# EAGLE design snc98_3x4_Switch-futuba (EAGLE 6.6.0)
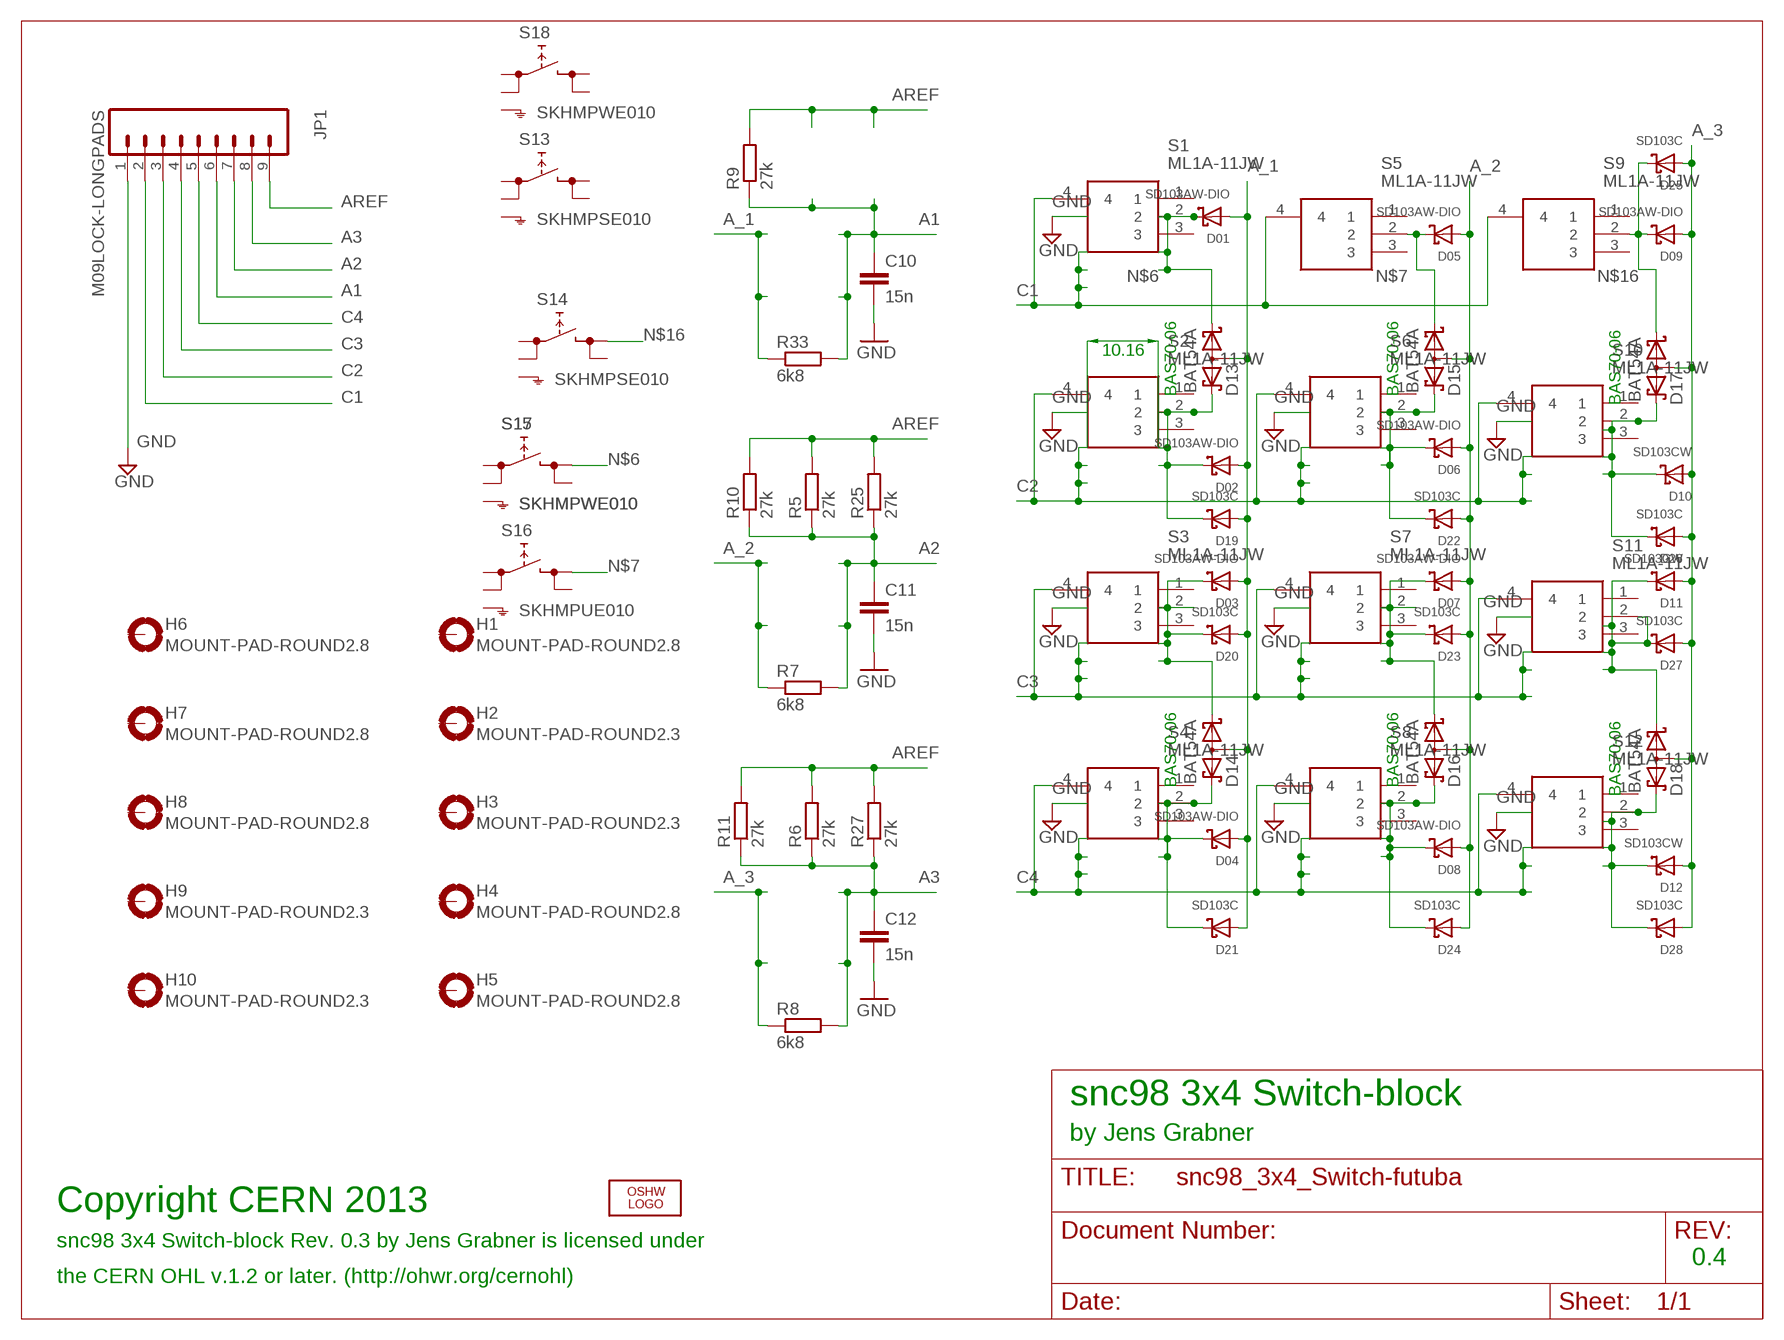
[diagram p0: schematic, sheet 1]

## Parts
C10  15n  C-EUC1206K  [C1206K]
C11  15n  C-EUC1206K  [C1206K]
C12  15n  C-EUC1206K  [C1206K]
D01  SD103AW-DIO  DIODESOD-123F  [SOD-123F]
D02  SD103AW-DIO  DIODESOD-123F  [SOD-123F]
D03  SD103AW-DIO  DIODESOD-123F  [SOD-123F]
D04  SD103AW-DIO  DIODESOD-123F  [SOD-123F]
D05  SD103AW-DIO  DIODESOD-123F  [SOD-123F]
D06  SD103AW-DIO  DIODESOD-123F  [SOD-123F]
D07  SD103AW-DIO  DIODESOD-123F  [SOD-123F]
D08  SD103AW-DIO  DIODESOD-123F  [SOD-123F]
D09  SD103AW-DIO  DIODESOD-123F  [SOD-123F]
D10  SD103CW  DIODESOD-123F  [SOD-123F]
D11  SD103CW  DIODESOD-123F  [SOD-123F]
D12  SD103CW  DIODESOD-123F  [SOD-123F]
D13  BAT54A  [SOT23]
D14  BAT54A  [SOT23]
D15  BAT54A  [SOT23]
D16  BAT54A  [SOT23]
D17  BAT54A  [SOT23]
D18  BAT54A  [SOT23]
D19  SD103C  DIODE280MIL-TH  [280MIL-TH]
D20  SD103C  DIODE280MIL-TH  [280MIL-TH]
D21  SD103C  DIODE280MIL-TH  [280MIL-TH]
D22  SD103C  DIODE280MIL-TH  [280MIL-TH]
D23  SD103C  DIODE280MIL-TH  [280MIL-TH]
D24  SD103C  DIODE280MIL-TH  [280MIL-TH]
D25  SD103C  DIODE280MIL-TH  [280MIL-TH]
D26  SD103C  DIODE280MIL-TH  [280MIL-TH]
D27  SD103C  DIODE280MIL-TH  [280MIL-TH]
D28  SD103C  DIODE280MIL-TH  [280MIL-TH]
H1  MOUNT-PAD-ROUND2.8  [2,8-PAD]
H2  MOUNT-PAD-ROUND2.3  [2,3-PAD]
H3  MOUNT-PAD-ROUND2.3  [2,3-PAD]
H4  MOUNT-PAD-ROUND2.8  [2,8-PAD]
H5  MOUNT-PAD-ROUND2.8  [2,8-PAD]
H6  MOUNT-PAD-ROUND2.8  [2,8-PAD]
H7  MOUNT-PAD-ROUND2.8  [2,8-PAD]
H8  MOUNT-PAD-ROUND2.8  [2,8-PAD]
H9  MOUNT-PAD-ROUND2.3  [2,3-PAD]
H10  MOUNT-PAD-ROUND2.3  [2,3-PAD]
JP1  M09LOCK-LONGPADS  [1X09_LOCK_LONGPADS]
LOGO1  OSHW_LOGO_8MILX0150-NT  [OSHW_8X150_NOTEXT]
R5  27k  R-EU_R1206  [R1206]
R6  27k  R-EU_R1206  [R1206]
R7  6k8  R-EU_M0805  [M0805]
R8  6k8  R-EU_M0805  [M0805]
R9  27k  R-EU_M0805  [M0805]
R10  27k  R-EU_M0805  [M0805]
R11  27k  R-EU_M0805  [M0805]
R25  27k  R-EU_0204/5  [0204/5]
R27  27k  R-EU_0204/5  [0204/5]
R33  6k8  R-EU_M0805  [M0805]
S1  ML1A-11JW  [ML1A11JW]
S2  ML1A-11JW  [ML1A11JW]
S3  ML1A-11JW  [ML1A11JW]
S4  ML1A-11JW  [ML1A11JW]
S5  ML1A-11JW  [ML1A11JW]
S6  ML1A-11JW  [ML1A11JW]
S7  ML1A-11JW  [ML1A11JW]
S8  ML1A-11JW  [ML1A11JW]
S9  ML1A-11JW  [ML1A11JW]
S10  ML1A-11JW  [ML1A11JW]
S11  ML1A-11JW  [ML1A11JW]
S12  ML1A-11JW  [ML1A11JW]
S13  SKHMPSE010  [SKHMPXE010]
S14  SKHMPSE010  [SKHMPXE010]
S15  SKHMPWE010  [SKHMPXE010]
S16  SKHMPUE010  [SKHMPXE010]
S17  SKHMPWE010  [SKHMPXE010]
S18  SKHMPWE010  [SKHMPXE010]

## Nets
A1: C10.1 JP1.6 R9.1 R33.2
A2: C11.1 JP1.7 R5.1 R7.2 R10.1 R25.1
A3: C12.1 JP1.8 R6.1 R8.2 R11.1 R27.1
A_1: D01.A D02.A D03.A D04.A D13.3(AA) D14.3(AA) D19.P$1(A) D20.P$1(A) D21.P$1(A) R33.1
A_2: D05.A D06.A D07.A D08.A D15.3(AA) D16.3(AA) D22.P$1(A) D23.P$1(A) D24.P$1(A) R7.1
A_3: D09.A D10.A D11.A D12.A D17.3(AA) D18.3(AA) D25.P$1(A) D26.P$1(A) D27.P$1(A) D28.P$1(A) R8.1
AREF: JP1.9 R5.2 R6.2 R9.2 R10.2 R11.2 R25.2 R27.2
C1: JP1.2 S1.4 S5.4 S9.4
C2: JP1.3 S2.4 S6.4 S10.4
C3: JP1.4 S3.4 S7.4 S11.4
C4: JP1.5 S4.4 S8.4 S12.4
GND: C10.2 C11.2 C12.2 JP1.1
N$2: D04.C D14.2(K2) D21.P$2(C) S4.2
N$6: D01.C D13.1(K1) S1.2 S15.3(2.1) S17.3(2.1)
N$7: D05.C D15.1(K1) S5.2 S16.3(2.1)
N$8: S15.1(1.1) S17.1(1.1)
N$9: S15.2(1.2) S17.2(1.2)
N$10: S15.4(2.2) S17.4(2.2)
N$11: S15.5(SH) S17.5(SH)
N$16: D09.C D17.1(K1) D25.P$2(C) S9.2 S14.3(2.1)
N$18: D10.C D17.2(K2) D26.P$2(C) S10.2
N$19: D02.C D13.2(K2) D19.P$2(C) S2.2
N$21: D11.C D18.1(K1) D27.P$2(C) S11.2
N$22: D12.C D18.2(K2) D28.P$2(C) S12.2
N$25: D06.C D15.2(K2) D22.P$2(C) S6.2
N$28: D07.C D16.1(K1) D23.P$2(C) S7.2
N$30: D08.C D16.2(K2) D24.P$2(C) S8.2
N$32: D03.C D14.1(K1) D20.P$2(C) S3.2
Unconnected: H1.B2,8(MOUNT) H2.B2,8(MOUNT) H3.B2,8(MOUNT) H4.B2,8(MOUNT) H5.B2,8(MOUNT) H6.B2,8(MOUNT) H7.B2,8(MOUNT) H8.B2,8(MOUNT) H9.B2,8(MOUNT) H10.B2,8(MOUNT) S1.1 S1.3 S2.1 S2.3 S3.1 S3.3 S4.1 S4.3 S5.1 S5.3 S6.1 S6.3 S7.1 S7.3 S8.1 S8.3 S9.1 S9.3 S10.1 S10.3 S11.1 S11.3 S12.1 S12.3 S13.1(1.1) S13.2(1.2) S13.3(2.1) S13.4(2.2) S13.5(SH) S14.1(1.1) S14.2(1.2) S14.4(2.2) S14.5(SH) S16.1(1.1) S16.2(1.2) S16.4(2.2) S16.5(SH) S18.1(1.1) S18.2(1.2) S18.3(2.1) S18.4(2.2) S18.5(SH)

## Notes on the sheet
- BAS70-06 | BAS70-06
- BAS70-06
- BAS70-06 | BAS70-06
- BAS70-06
- snc98 3x4 Switch-block
- by Jens Grabner
- Copyright CERN 2013
- snc98 3x4 Switch-block Rev. 0.3 by Jens Grabner is licensed under
- 0.4
- the CERN OHL v.1.2 or later. (http://ohwr.org/cernohl)

## Library data of the parts
C10-C12 = rcl:C-EU: CAPACITOR, European symbol; OC_FARNELL: unknown; TME_EU: CC0805KRX7R9153
D01-D09 D10-D12 D19-D28 = BaseApp:DIODE; MF: MULTICOMP; MPN: SD103CW-7-F; OC_FARNELL: 2306221
D13-D18 = diode:BAT54A: Schottky Diodes Source: Fairchild .. BAT54.pdf; OC_FARNELL: unknown; TME_EU: BAT54A-DIO
H1-H10 = holes:MOUNT-PAD-ROUND: MOUNTING PAD, round; OC_FARNELL: unknown
JP1 = SparkFun-Connectors:M09: Header 9 Standard 9-pin 0.1" header. Use with straight break away headers (SKU : PRT-00116), right angle break away headers (PRT-00553), swiss pins (PRT-00743), machine pins (PRT-00117), and female headers (PRT-00115).; OC_FARNELL: unknown
LOGO1 = ohw-logo:OSHW_LOGO_8MIL; OC_FARNELL: unknown
R5 R6 R25 R27 = rcl:R-EU_: RESISTOR, European symbol; OC_FARNELL: unknown
R7 R8 R33 = rcl:R-EU_: RESISTOR, European symbol; OC_FARNELL: unknown; TME_EU: RC0805FR-076K8
R9-R11 = rcl:R-EU_: RESISTOR, European symbol; OC_FARNELL: unknown; TME_EU: RC0805FR-0727K
S1-S12 = ML1A-11JW:ML1A-11JW: Pushbutton Switches Ultra-Low Profile Mech. Keyswitch, Linear Feel Fixation Pins for PCB Mounting Jumper (for double sided PCB applications) Source: Datasheet <http://switches-sensors.zf.com/wp-content/blogs.dir/7/2012/07/Keymodule_ML_EN.pdf>; DESCRIPTION: Pushbutton Switches Ultra-Low Profile Mech. Keyswitch, Linear Feel Fixation Pins for PCB Mounting Jumper (for double sided PCB applications); HEIGHT: 6.9mm; MANUFACTURER_NAME: Cherry; MANUFACTURER_PART_NUMBER: ML1A-11JW; MOUSER_PART_NUMBER: 540-ML1A-11JW; MOUSER_PRICE-STOCK: https://www.mouser.co.uk/ProductDetail/CHERRY/ML1A-11JW?qs=AQlKX63v8RtEVEgKx51JBA%3D%3D
S13-S18 = switch:SKHMP*E010: 6.2 X 6.5mm TACT Switch (SMD) Source: http://www3.alps.co.jp/WebObjects/catalog.woa/PDF/E/Switch/Tact/SKHM/SKHM.PDF

## Net classes
0 default: clearance 0.205 mm

## Board
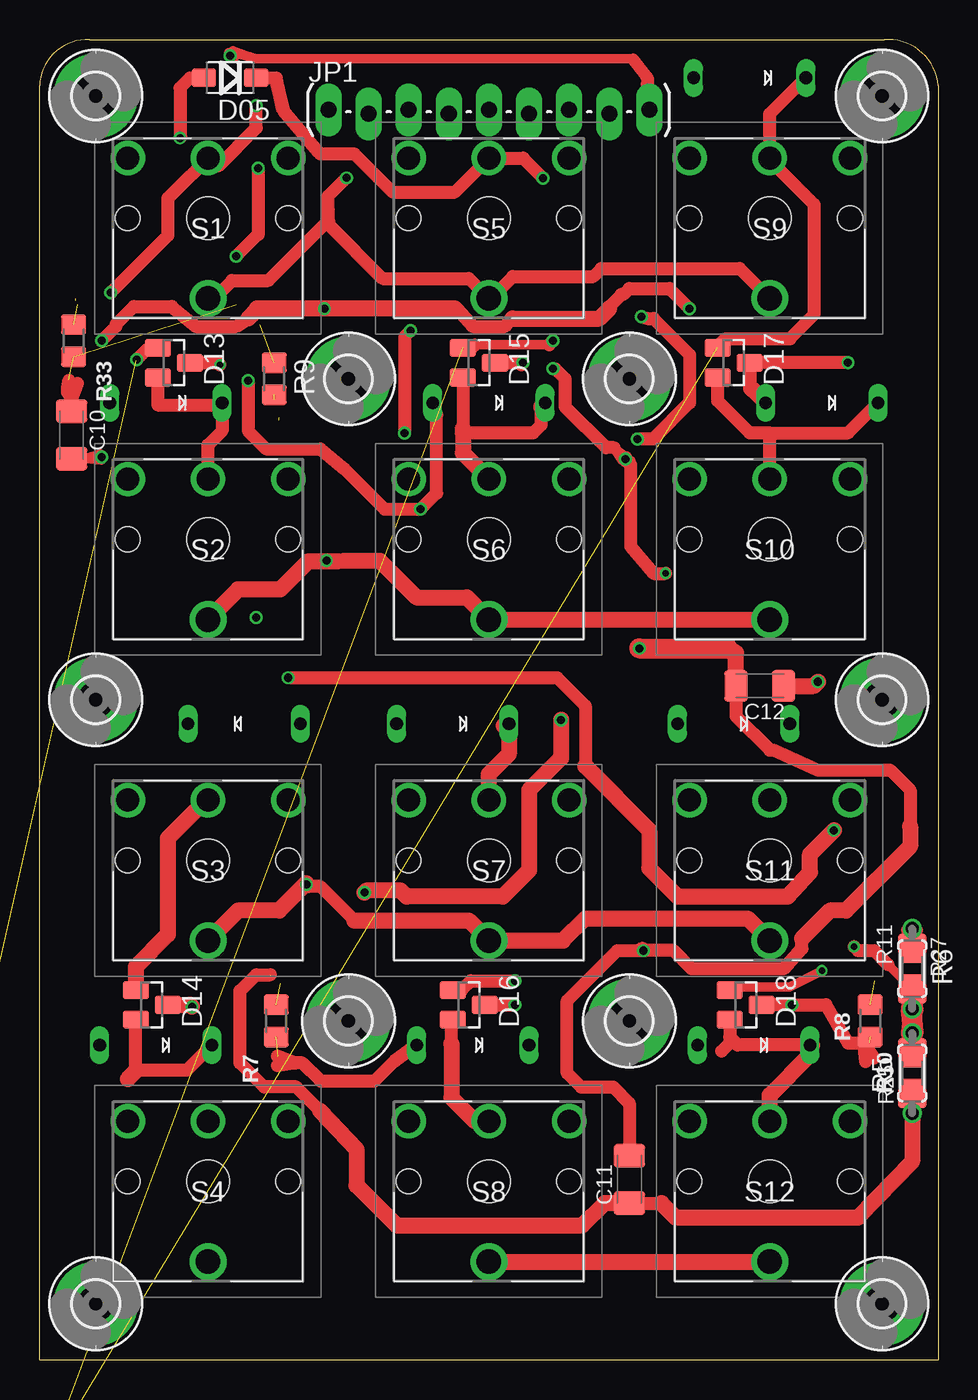
[diagram p1: board, top side]
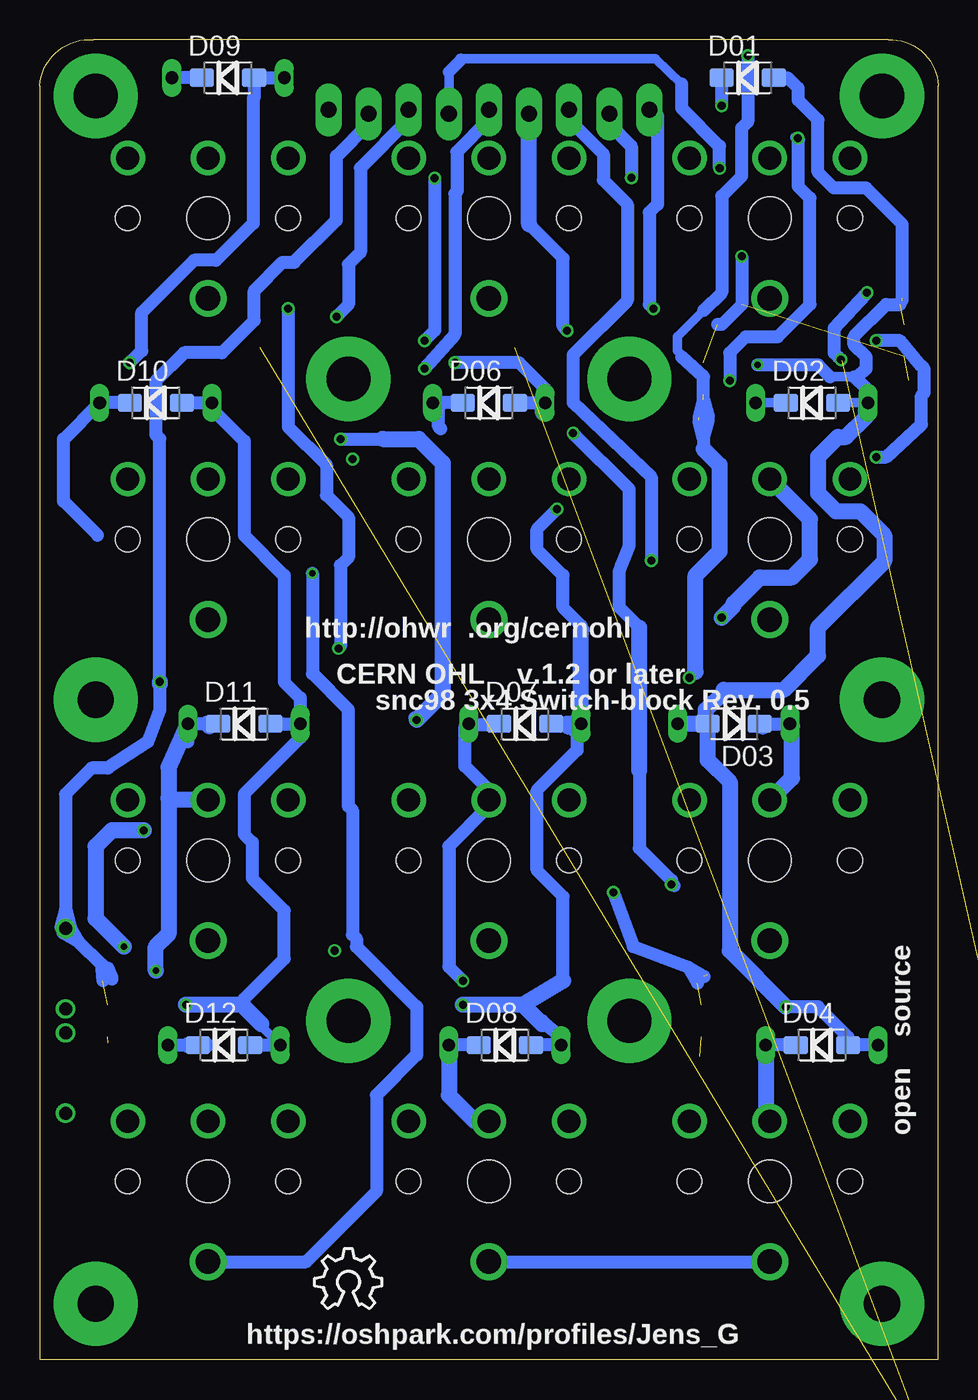
[diagram p2: board, bottom side, seen from below]

Size 56.9 x 83.58 mm. Coordinates in mm from the lower left corner, seen from the top.
Outline: 0,0 0,80.64 arc-90 3.17,83.57 53.47,83.57 arc-90 56.9,80.64 56.9,0 0,0
Copper layers (1*16): Top 0.035559375mm / dielectric 1.6mm / Bottom 0.035559375mm
Design rules "oshpark-2layer-auto-routing *": minimum track width 12mil, minimum drill 12mil, track to track 12mil, track to pad 8mil, pad to pad 8mil, via to via 8mil, smd to smd 6mil, copper to edge 15mil, drill to drill 6mil, minimum pad ring 6mil, minimum via ring 6mil, stop-mask expansion 2.5mil, vias tented up to drill 0mil, thermal gap 10mil

### Footprints (pad centres in the part's own frame; a part is rotated, then mirrored left to right if it is on the bottom)
C1206K = smd 1.5 x 2: 1 -1.5,0; 2 1.5,0
SOD-123F = smd 1.524 x 1.143: A 1.651,0; C -1.651,0
SOT23 = smd 1.143 x 1.651: 1 -0.94,-1.016; 2 0.94,-1.016; 3 0,1.016
280MIL-TH = drill 0.8 long: P$1 -3.556,0; P$2 3.556,0
2,8-PAD = drill 2.8 pad 5.334: B2,8 0,0
2,3-PAD = drill 2.3 pad 5.334: B2,8 0,0
1X09_LOCK_LONGPADS = drill 1.016 pad 1.676 long: 1 0,0.127; 2 2.54,-0.127; 3 5.08,0.127; 4 7.62,-0.127; 5 10.16,0.127; 6 12.7,-0.127; 7 15.24,0.127; 8 17.78,-0.127; 9 20.32,0.127
R1206 = smd 1.6 x 1.803: 1 -1.422,0; 2 1.422,0
M0805 = smd 1.3 x 1.6: 1 -1.016,0; 2 1.016,0
0204/5 = drill 0.813: 1 -2.54,0; 2 2.54,0
ML1A11JW = drill 1.45 pad 2.175: 1 0,0; 2 5.08,0; 3 10.16,0 | drill 1.55 pad 2.325: 4 5.08,-8.89 | hole 1.55: 0,-3.81; 10.16,-3.81 | hole 2.7: 5.08,-3.81
SKHMPXE010 = smd 1.016 x 0.508: 1 -4.2,2.25 | smd 1.6 x 1.4: 2 4.2,2.25; 3 -4.2,-2.25; 4 4.2,-2.25; 5 4.2,0

### Placement (x,y rotation side)
C10  2.03,58.55 270 top
C11  37.34,11.43 90 top
C12  45.59,42.67 180 top
D01  12.06,81.15 0 bottom
D02  8,60.58 0 bottom
D03  12.95,40.26 180 bottom
D04  7.37,19.94 0 bottom
D05  12.06,81.15 180 top
D06  28.45,60.58 0 bottom
D07  26.16,40.26 0 bottom
D08  27.43,19.94 0 bottom
D09  44.96,81.15 0 bottom
D10  49.53,60.58 0 bottom
D11  43.94,40.26 0 bottom
D12  45.21,19.94 0 bottom
D13  8.51,63.12 270 top
D14  7.11,22.48 270 top
D15  27.81,63.12 270 top
D16  27.18,22.48 270 top
D17  43.94,63.12 270 top
D18  44.7,22.48 270 top
D19  8,60.58 0 top
D20  12.95,40.26 180 top
D21  7.37,19.94 0 top
D22  28.45,60.58 0 top
D23  26.16,40.26 0 top
D24  27.43,19.94 0 top
D25  44.96,81.15 0 top
D26  49.53,60.58 0 top
D27  43.94,40.26 0 top
D28  45.21,19.94 0 top
H1  3.56,80.01 0 top
H2  3.56,41.78 0 top
H3  3.56,3.56 0 top
H4  19.56,62.1 0 top
H5  19.56,21.46 0 top
H6  37.34,62.1 0 top
H7  37.34,21.46 0 top
H8  53.34,80.01 0 top
H9  53.34,41.78 0 top
H10  53.34,3.56 0 top
JP1  18.29,78.99 0 top
LOGO1  39.47,3.25 0 bottom
R5  55.24,18.16 90 top
R6  55.24,24.77 270 top
R7  14.99,21.46 90 top
R8  52.58,21.46 90 top
R9  14.86,62.1 270 top
R10  55.24,18.16 90 top
R11  55.24,24.77 270 top
R25  55.24,18.16 90 top
R27  55.24,24.77 270 top
R33  2.16,64.52 270 top
S1  5.59,76.07 0 top
S2  5.59,55.75 0 top
S3  5.59,35.43 0 top
S4  5.59,15.11 0 top
S5  23.37,76.07 0 top
S6  23.37,55.75 0 top
S7  23.37,35.43 0 top
S8  23.37,15.11 0 top
S9  41.15,76.07 0 top
S10  41.15,55.75 0 top
S11  41.15,35.43 0 top
S12  41.15,15.11 0 top
S13  -15.24,-26.67 0 top  (outside the outline)
S14  -15.24,-36.83 0 top  (outside the outline)
S15  -15.24,-46.99 0 top  (outside the outline)
S16  -15.24,-57.15 0 top  (outside the outline)
S17  -15.24,-67.31 0 top  (outside the outline)
S18  -15.24,-77.47 0 top  (outside the outline)

### Tracks (layer width: path | path; a pad name or v marks a point on that pad's centre or on a via)
A1  (via drill 0.51)  (3 unrouted)
  Top 0.813: C10.1 2.03,60.82 | 2.03,60.82 1.78,61.26 | 1.78,61.26 1.78,61.59 | 1.78,61.26 2.35,61.74 | 1.78,61.26 1.86,62.01 | 2.03,60.82 2.42,61.81 | 2.03,60.82 1.85,62 | v13.84,75.44 13.84,71.25 v12.45,69.85
  Bottom 0.61: JP1.6 30.99,81.53 | 30.23,82.3 30.1,82.37 17.91,82.37 16.26,80.77
  Bottom 0.762: 30.99,81.53 30.23,82.3
  Bottom 0.813: 16.26,80.77 16.26,79.25 13.84,76.83 v13.84,75.44 | v12.45,69.85 12.45,66.8 13.72,65.53 13.97,65.53
A2  (via drill 0.51)  (2 unrouted)
  Top 0.813: v38.1,66.04 38.48,65.91 38.86,65.91 41.15,63.63 41.15,60.58 38.86,58.29 v37.85,58.29 | R25.1 R5.1 R10.1 | C11.1 39.39,9.93 | 17.78,15.75 16.26,17.27 14.22,17.27 12.7,18.8 12.7,23.37 13.72,24.38 14.61,24.38
  Top 1.016: v33.02,40.51 33.02,38.1 30.99,36.07 30.99,30.99 29.34,29.34 23.24,29.34 22.86,29.72 20.7,29.72 v20.57,29.59 | C11.1 35.79,9.93 34.37,8.51 22.61,8.51 20.07,11.05 20.07,13.34 17.78,15.75 | 39.39,9.93 39.39,9.88 40.26,9.02 51.82,9.02 55.24,12.57 R25.1
  Bottom 0.813: v37.85,58.29 35.18,58.29 | v20.57,29.59 19.3,26.16 15.85,24.86 | 15.85,24.86 15.56,24.58 | 15.56,24.58 14.87,24.28 | 15.56,24.58 15.27,23.88 | 15.85,24.86 14.83,24.27 | 15.85,24.86 15.25,23.85 | 33.15,40.64 v33.02,40.51 | 33.53,79.5 33.53,78.49 36.58,75.44 36.58,70.1 37.34,69.34 37.34,66.8 v38.1,66.04
  Bottom 1.016: JP1.7 33.53,79.5 | 35.18,58.29 32.89,58.29 31.37,56.77 31.37,42.16 v33.02,40.51
A3  (via drill 0.51)  (1 unrouted)
  Top 0.61: R11.1 R27.1
  Top 0.813: R6.1 55.24,26.49 | 55.24,26.49 R27.1 | 55.24,26.49 55.53,27.19 R27.1 | 55.24,26.49 54.96,27.19 R27.1
  Top 1.016: C12.1 49.02,42.67 v49.28,42.93
  Bottom 0.813: 52.58,24.82 52.7,24.77 53,25.06 | 53,25.06 54.38,26.44 | 54.38,26.44 54.67,26.73 | 54.67,26.73 R27.1 | 49.28,42.8 49.28,41.15 50.04,39.12 52.58,37.47 53.59,37.47 55.24,35.81 55.24,28.52 | 55.24,28.52 55.24,28.12 | 55.24,28.12 R27.1 | 54.67,26.73 55.36,27.02 R27.1 | 54.67,26.73 54.96,27.42 R27.1 | 55.24,28.12 54.96,27.42 R27.1 | 55.24,28.12 55.53,27.42 R27.1 | 52.58,24.82 52.3,24.12 | 52.58,24.82 52.86,24.12 | 54.38,26.44 55.4,27.04 R27.1 | 54.38,26.44 54.98,27.46 R27.1 | 55.24,28.52 54.95,27.38 R27.1 | 55.24,28.52 55.54,27.38 R27.1 | 53,25.06 52.31,24.15 | 53,25.06 52.88,24.01 | v49.28,42.93 49.28,58.29 49.53,58.55 49.53,61.98 47.75,63.75 45.34,63.75 43.31,65.79 43.31,67.69 41.53,69.47 40.77,69.47 38.1,72.14 38.1,76.2 36.07,78.23 JP1.8
  Bottom 1.016: v49.28,42.93 49.28,42.8
A_1  (via drill 0.41, 0.51)  (2 unrouted)
  Top 0.813: D13.3 11.3,63.12 v11.43,62.99
  Top 1.016: D14.3 9.53,22.48 v9.65,22.35
  Bottom 0.61: D04.A 5.33,19.94 4.7,19.94 | D02.A D19.P$1 | 6.86,62.23 5.33,62.23
  Bottom 0.813: D21.P$1 5.33,19.94 | v11.43,62.99 7.62,62.99 6.86,62.23 | D19.P$1 4.57,60.71 4.57,61.47 5.33,62.23 5.08,62.23 4.57,62.74 4.57,63.5 5.33,64.26 5.33,64.77 3.3,66.8 2.54,66.8 | 2.54,66.8 2.41,66.8 | 2.54,66.8 2.29,67.06 | D01.A 9.53,81.15 8.89,80.52 8.89,79.76 7.62,78.49 7.62,75.18 6.6,74.17 4.57,74.17 2.29,71.88 2.29,67.18 | D04.A 5.71,20.45 7.62,22.35 v9.65,22.35
  Bottom 1.016: D19.P$1 4.57,60.45 4.57,59.69 5.84,58.42 6.35,58.42 7.62,57.15 7.62,54.86 6.48,53.72 4.95,53.72 3.43,52.2 3.43,50.55 7.62,46.35 7.62,44.58 9.78,42.42 13.59,42.42 13.59,42.29 14.73,41.15 14.73,40.39 D03.A | D03.A D20.P$1 | D03.A 14.61,37.97 13.21,36.58 13.21,25.91 v9.65,22.35
A_2  (via drill 0.51)  (1 unrouted)
  Top 0.813: D16.3 v30.1,22.48 | 8.95,77.41 v8.89,77.34 8.89,80.52 9.53,81.15 D05.A | v13.21,61.98 13.21,58.8 14.35,57.66 17.78,57.66 19.3,56.39 21.84,53.85 v24.13,53.85 25.15,54.86 25.15,59.82 25.02,59.94 25.02,60.45 D22.P$1 | v30.61,63.12 D15.3 30.35,63.12 30.48,62.99 | D24.P$1 22.48,18.92 21.21,17.65 17.78,17.65 16.64,18.8 16.2,18.8 | 16.2,18.8 15.8,18.92 | 15.8,18.92 15.1,19.21 | 15.8,18.92 15.1,18.64 | 16.2,18.8 15.06,19.22 | 16.2,18.8 15.06,18.63
  Bottom 0.33: 22.61,40.39 D23.P$1 22.99,40.51 23.37,40.26
  Bottom 0.61: v8.89,77.34 8.89,77.15 | v8.89,77.34 9.09,77.37 | v8.89,77.34 8.73,77.22 | v8.89,77.34 9.09,77.39 | v8.89,77.34 8.73,77.22 | D07.A 23.81,40.26
  Bottom 0.813: 25.08,21.27 25.08,21.46 23.88,20.45 D24.P$1 D08.A | 23.5,40.26 23.75,40.26 | 23.75,40.26 23.5,40.01 23.24,40.01 22.86,39.62 22.86,38.61 25.4,36.07 25.4,30.99 23.75,29.34 23.75,24 | 23.75,40.26 23.81,40.26 | v30.61,63.12 26.54,63.12 24.89,61.47 D22.P$1 D06.A | 22.73,40.26 22.61,40.39 | 22.61,46.23 22.61,46.48 23.75,47.62 23.75,49.66 25.4,51.31 25.4,52.58 v24.13,53.85 | 25.02,60.45 25.02,60.58 24.96,60.52 | v13.21,61.98 13.21,63.75 12.19,64.77 10.16,64.77 8.13,66.8 8.13,73.53 8.89,74.3 v8.89,77.34 | 8.89,77.15 8.89,76.96
  Bottom 1.016: 25.08,21.27 26.29,22.48 | 26.29,22.48 v30.1,22.48 | 23.5,40.26 23.37,40.26 | 22.61,40.39 22.61,46.23 | 25.02,59.94 25.02,60.45 D22.P$1 | 23.75,24 26.29,22.48
A_3  (via drill 0.51)  (1 unrouted)
  Top 0.813: D18.3 v47.62,22.48 49.78,22.48 51.18,20.07 52.15,20.07 | v51.18,63.12 D17.3 44.96,61.59 45.15,61.4 | 52.15,20.07 52.55,20.07 | 52.15,20.07 52.27,18.89 | 52.15,20.07 52.83,19.1
  Top 1.016: 45.04,61.51 45.15,61.4 D26.P$1
  Bottom 0.61: 42.86,21.27 42.86,21.14 D28.P$1 | D11.A 41.53,40.26
  Bottom 0.813: v51.18,63.12 50.42,63.88 50.42,66.29 47.12,69.6 45.72,69.6 43.37,71.94 43.37,79.88 43.31,79.95 D09.A D25.P$1 | D10.A D26.P$1 45.97,60.2 43.94,58.17 43.94,52.2 41.4,49.66 41.4,42.93 40.39,41.91 D27.P$1 40.51,40.26 | D12.A D28.P$1 | 41.53,40.26 40.51,40.26 | 40.51,40.26 40.39,40.13 40.39,39.37 43.94,35.81 43.94,33.27 43.43,32.77 43.43,30.48 41.4,28.45 41.4,25.4 43.94,22.86 43.94,22.35
  Bottom 1.016: 42.86,21.27 43.94,22.35 44.07,22.48 v47.62,22.48
AREF  (via drill 0.41, 0.51)  (2 unrouted)
  Top 0.61: 13.66,82.37 37.57,82.37 37.59,82.3 | 13.66,82.37 12.27,82.88 12.32,82.42 12.22,82.42 v12.06,82.55 11.97,82.73 | R6.2 55.24,23.44 | 55.24,23.44 55.24,23.5 53.72,25.02 | 55.24,23.44 54.86,22.36 R27.2 | 55.24,23.44 55.63,22.36 R27.2 | R10.2 R25.2 | R11.2 R27.2 | 13.66,82.37 12.19,82.8
  Top 0.762: 38.48,81.15 37.59,82.3
  Top 0.813: 38.48,81.15 38.48,80.77 JP1.9 | R25.2 55.24,21.01 | 55.24,21.01 55.24,21.41 | 55.24,21.41 55.24,21.51 | 55.24,21.51 55.24,21.92 | 55.24,21.92 R27.2 | R6.2 55.24,23.04 | 55.24,23.04 R27.2 | R5.2 55.24,19.89 | 55.24,19.89 R25.2 | v15.75,43.18 32.77,43.18 34.54,41.4 34.54,37.59 | 55.24,21.51 55.05,21.02 | 55.05,21.02 54.96,20.82 R25.2 | 55.24,21.51 55.53,20.82 R25.2 | 55.24,19.89 55.53,20.59 R25.2 | 55.24,19.89 54.96,20.59 R25.2 | 55.24,21.41 55.53,22.11 R27.2 | 55.24,21.41 55.05,21.9 | 55.05,21.9 54.96,22.11 R27.2 | 55.24,23.04 54.96,22.34 R27.2 | 55.24,23.04 55.53,22.34 R27.2 | 55.24,21.92 54.95,20.78 R25.2 | 55.24,21.92 55.54,20.78 R25.2 | R25.2 54.97,20.82 55.44,21.9 55.55,20.73 R25.2 | 55.05,21.9 54.94,20.73 R25.2 | 55.05,21.9 55.52,20.82 R25.2 | 55.24,21.01 55.54,22.15 R27.2 | 55.24,21.01 54.95,22.15 R27.2 | 55.05,21.02 55.52,22.1 R27.2 | 55.05,21.02 54.94,22.2 R27.2 | R27.2 55.55,22.2 55.44,21.02 54.97,22.1 R27.2 | 53.72,25.02 52.83,25.91 51.82,25.91 v51.56,26.16
  Top 1.016: 34.54,37.59 38.61,33.53 38.61,31.11 40.39,29.34 47.37,29.34 48.77,30.86 48.77,32 v50.29,33.53
  Bottom 0.61: 16.26,63.5 16.26,63.63 16.51,63.88 16.51,64.77 14.86,66.42 13.84,67.44
  Bottom 0.813: 14.86,60.38 14.86,60.78 | 14.86,60.78 14.86,62.23 16.26,63.5 | v12.06,82.55 12.06,78.36 12.45,77.98 12.45,74.93 13.72,73.66 13.72,67.56 14.86,66.42 | 14.86,58.75 14.86,58.34 | 14.86,58.34 14.86,57.66 | 15.37,43.56 v15.75,43.18 | 14.86,60.38 14.58,59.68 | 14.86,60.38 15.14,59.68 | 14.86,58.75 15.14,59.45 | 14.86,58.75 14.58,59.45 | 14.86,60.78 14.56,59.64 | 14.86,60.78 15.15,59.64 | 14.86,58.34 15.15,59.49 | 14.86,58.34 14.56,59.49
  Bottom 1.016: v50.29,33.53 52.32,33.53 53.34,32.51 53.34,27.94 v51.56,26.16 | 15.37,43.56 15.37,49.66 13.84,51.18 13.84,56.64 14.86,57.66
C1  (via drill 0.51)
  Top 0.813: 18.29,72.14 14.48,68.33 12.19,68.33 11.05,67.18 S1.4 | 18.29,72.14 18.27,73.66 v19.43,74.82 | 18.29,72.14 18.29,71.88 21.72,68.45 27.18,68.45 S5.4 28.57,67.18 29.97,68.58 35.05,68.58 35.56,69.09 44.32,69.09 S9.4
  Bottom 0.813: 20.83,78.23 19.43,76.83 v19.43,74.82
  Bottom 1.016: JP1.2 20.83,78.23
C2  (via drill 0.51)
  Top 0.813: 18.87,50.55 v18.16,50.6 19.25,50.6
  Top 1.016: S2.4 12.57,48.77 15.24,48.77 17.02,50.55 18.87,50.55 | 19.25,50.6 21.54,50.6 23.88,48.26 27.05,48.26 S6.4 S10.4
  Bottom 0.813: JP1.3 23.37,78.49 21.21,76.33 21.21,74.68 19.68,73.15 19.68,67.06 23.11,63.63 23.11,60.58 18.16,55.88 v18.16,50.6
C3  (via drill 0.51)
  Top 0.813: v23.5,65.15 23.11,64.77 v23.11,58.67 | 19.94,27.81 17.78,29.97 17.02,29.97 v16.89,30.1 16.67,29.88 16.6,29.88
  Top 1.016: 16.89,30.17 16.6,29.88 15.17,28.45 12.57,28.45 S3.4 | 19.94,27.81 27.18,27.81 S7.4 33.15,26.54 34.54,27.94 44.83,27.94 S11.4
  Bottom 0.813: 18.92,46.35 20.19,47.62 20.19,49.91 20.07,50.29 19.56,51.56 19.56,55.12 v23.11,58.67 | v23.5,65.15 23.75,65.41 23.75,69.72 25.91,71.88 | 18.92,37.34 18.92,32.38 16.89,30.35 16.89,30.17 16.86,30.13 | v16.89,30.1 16.86,30.13 | 16.86,30.13 16.73,30.01
  Bottom 1.016: 18.92,37.34 18.92,46.35 | 25.91,71.88 JP1.4
C4  (via drill 0.41, 0.51)
  Top 0.61: 36.37,57.74 37.05,56.8 | 37.05,56.8 v37.08,57.02 | 37.05,56.8 37.41,56.67 v37.08,57.02 | 37.05,56.8 37.18,57.2 v37.08,57.02 | 36.37,57.74 36.91,56.91 v37.08,57.02 | 36.37,57.74 37.45,56.94 v37.08,57.02
  Top 0.813: 37.41,56.67 37.41,51.48 38.86,49.78 v39.62,49.78 | S8.4 28.96,6.22 | v32.51,62.74 32.64,62.74 33.27,62.1 33.27,60.33 35.86,57.74 36.37,57.74
  Top 1.016: 28.96,6.22 S12.4
  Bottom 0.813: JP1.5 28.45,78.49 30.48,76.45 30.48,73.91 30.61,73.79 30.61,64.9 v32.51,62.74 | v39.62,49.78 39.62,43.43 37.34,41.15 37.34,35.05 37.08,34.8 37.08,26.92 36.83,26.67 36.83,26.16 33.02,22.35 33.02,19.3 35.56,16.76 35.56,10.67 40.01,6.22 S12.4 | S8.4 S4.4
GND  (via drill 0.51)
  Top 0.61: C10.2 2.93,57.05 | 2.93,57.05 3.18,57.05 | 3.18,57.05 3.83,57.05 v3.94,57.15 | 3.18,57.05 3.91,56.95 v3.94,57.15 | 3.18,57.05 3.86,57.34 v3.94,57.15 | 2.93,57.05 3.92,56.95 v3.94,57.15 | 2.93,57.05 3.88,57.34 v3.94,57.15
  Top 0.813: 38.35,25.91 38.23,26.04 38.1,26.04 v38.23,25.91 | v3.94,64.52 4.83,65.41 4.83,65.53 5.97,66.67 8.38,66.67 9.91,65.41 12.45,65.41 13.21,65.91 | 36.07,66.55 36.07,66.67 36.83,67.44 36.96,67.44 37.34,67.82 39.88,67.82 v41.15,66.55 | v38.23,25.91 36.58,25.91 33.4,22.73 33.4,18.16 34.29,17.27 36.32,17.27 37.34,16.26 C11.2 | 26.29,66.55 26.42,66.55 27.43,65.41 29.46,65.41 29.84,65.91 29.97,65.91 | C12.2 44.09,40.74 46.23,38.61 46.48,38.61 49.28,37.34 53.85,37.34 55.12,36.07 55.12,33.78 | v38.23,25.91 40.13,25.91 41.27,24.77 47.12,24.77 48.26,26.04 48.26,26.67 48.26,26.8
  Top 1.016: 36.07,66.55 35.43,65.91 29.97,65.91 | 13.21,65.91 13.76,66.46 13.76,66.55 v18.03,66.55 26.29,66.55 | C12.2 44.09,44.77 43.56,45.04 | 55.12,33.78 55.12,32.51 51.05,28.45 50.04,28.45 48.26,26.67
  Top 1.27: v37.97,45.04 43.56,45.04
  Bottom 0.813: v41.15,66.55 41.15,59.05 38.73,56.64 38.73,54.74 37.34,53.34 37.34,50.8 37.85,50.29 37.85,45.17 v37.97,45.04 | 18.29,79.88 18.29,79.25 17.78,78.74 17.78,73.15 18.29,72.64 18.29,66.8 v18.03,66.55 | v3.94,57.15 3.3,57.15 1.07,59.21 1.07,61.04 0.89,61.21 0.89,62.74 1.07,62.92 2.41,64.52 v3.94,64.52
  Bottom 1.016: JP1.1 18.29,79.88
N$2
  Top 0.813: D14.2 6.1,18.41 6.16,18.35 9.34,18.35 D21.P$2
  Top 1.016: 5.59,17.78 6.16,18.35 | 10.79,19.81 D21.P$2
  Bottom 0.61: 9.14,19.81 8.89,19.81 D04.C | 8.76,19.81 8.88,19.81
  Bottom 0.813: 10.92,19.75 D21.P$2 D04.C 8.88,19.81
  Bottom 1.016: 10.92,19.75 10.92,15.37 S4.2
N$6  (via drill 0.51)  (2 unrouted)
  Top 0.61: v6.16,63.31 6.1,63.25
  Top 0.813: v6.16,63.31 6.86,64.01 7.44,64.01 D13.1 | v13.72,79.38 13.72,77.98 11.3,75.56 11.18,75.56 | 11.18,75.56 S1.2 | 11.18,75.56 11.05,76.45 8.13,73.53 8.13,71.17 v4.51,67.55
  Bottom 0.813: 4.55,67.51 6.6,65.28 6.6,63.75 v6.16,63.31 6.35,63.5 | 4.55,67.51 v4.51,67.55 4.55,67.51 | v13.72,79.38 D01.C
N$7  (via drill 0.51)  (1 unrouted)
  Top 0.61: 27.56,64.26 32.26,64.26
  Top 0.813: 15.42,79.11 17.65,76.45 17.78,76.33 19.94,76.33 22.35,73.91 26.29,73.91 S5.2 30.61,76.07 v31.88,74.8 | 15.42,79.11 14.99,81.15 | D05.C 14.9,81.15 15.42,79.11 | D15.1 27.36,64.06 27.56,64.26 | 32.26,64.26 v32.51,64.52
  Bottom 0.813: v31.88,74.8 31.88,65.15 v32.51,64.52
N$8  (1 unrouted)
N$9  (1 unrouted)
N$10  (1 unrouted)
N$11  (1 unrouted)
N$16  (1 unrouted)
  Top 0.813: D17.1 42.93,64.14 43.43,64.64 47.5,64.64 49.02,66.17 49.02,73.15 46.23,75.95 S9.2 46.23,78.87 D25.P$2
  Bottom 0.813: D09.C D25.P$2
N$18
  Top 0.813: D17.2 42.93,62 | 42.93,62 42.8,61.87 | 46.23,58.67 51.18,58.67 D26.P$2 | S10.2 46.23,58.67 | 42.93,62 42.93,60.71 44.96,58.67 46.23,58.67
  Bottom 0.813: D10.C D26.P$2 55.37,58.29 55.37,54.36 53.21,52.2
N$19  (via drill 0.51)
  Top 0.813: D13.2 7.49,60.45 11.43,60.45 D19.P$2 11.56,58.8 10.67,57.91 S2.2
  Bottom 0.33: D19.P$2 11.56,60.39
  Bottom 0.61: D02.C D19.P$2
  Bottom 1.016: v13.72,46.99 12.95,47.75 12.95,47.88 11.3,49.53 9.27,49.53 8.13,50.67 8.13,53.21 S2.2
N$21  (via drill 0.41)
  Top 0.61: 43.99,23.42 44.2,23.62 47.5,23.62 v49.53,24.64
  Top 1.016: D18.1 43.99,23.42
  Bottom 0.61: D11.C 45.97,40.26 46.13,40.1
  Bottom 0.813: 46.29,40.26 D27.P$2 47.5,39.12
  Bottom 1.016: D27.P$2 48.73,37.51 48.73,35.56 | 46.29,40.26 46.13,40.1 | v49.53,24.64 49.53,26.16 48.73,26.96 48.73,35.56 | S11.2 48.6,35.43 48.73,35.56
N$22
  Top 0.813: 48.58,19.94 44.2,19.94 43.88,20.26 | D18.2 43.69,20.45 43.88,20.26 | 43.18,19.56 43.88,20.26
  Top 1.016: S12.2 46.23,16.76 48.77,19.3 D28.P$2
  Top 1.27: D28.P$2 48.58,19.94
  Bottom 0.33: 47.75,19.94 47.5,19.94
  Bottom 0.813: D28.P$2 D12.C
  Bottom 1.016: 47.5,19.94 D12.C 46.35,19.94
N$25
  Top 0.813: D15.2 26.8,58.93 | 31.75,60.33 31.75,59.18 31.24,58.67 26.8,58.67
  Top 1.016: 31.75,60.33 D22.P$2 | 26.8,58.93 26.8,58.67 26.8,57.4 S6.2
  Bottom 0.813: D06.C D22.P$2 31.62,60.2 31.62,59.05 31.5,58.93
N$28  (via drill 0.51)
  Top 0.813: v30.1,24 27.3,24 26.72,23.42 D16.1
  Top 1.016: 29.4,40.13 29.53,40.26 D23.P$2 29.72,38.35 29.46,38.1 28.96,37.59 28.45,37.08 S7.2
  Bottom 0.33: D23.P$2 29.46,40.2
  Bottom 0.61: D07.C D23.P$2
  Bottom 0.813: 28.51,40.2 29.46,40.2 | D23.P$2 29.97,40.01 29.97,37.59 28.45,36.07 S7.2 28.45,35.05 30.99,32.51 30.99,24.89 v30.1,24
N$30
  Top 0.813: 26.08,20.03 26.08,21.45 D16.2
  Top 1.016: S8.2 27.56,15.11 26.08,16.59 26.08,20.03
  Bottom 0.61: 30.99,19.18 30.99,19.3
  Bottom 0.813: D24.P$2 31.11,19.81 31.11,19.43 31.05,19.37 31.05,20 30.99,20.07 30.73,20.07 | 30.99,19.3 D24.P$2 | 29.46,19.94 D24.P$2
  Bottom 1.016: 29.46,19.94 D08.C | 30.99,19.18 30.99,16.76 29.34,15.11 S8.2
N$32
  Top 0.813: D14.1 6.02,23.42 5.97,23.47
  Top 1.016: S3.2 10.54,35.43 8.13,33.02 8.13,26.92 6.1,24.89 D14.1
  Bottom 0.61: 11.42,40.25 11.18,40.01
  Bottom 0.813: D20.P$2 10.79,40.26 11.05,40.01 11.18,40.01 | D03.C 11.42,40.26 11.42,40.25
  Bottom 1.016: D20.P$2 9.27,40.13 9.27,36.83 S3.2

### Text on the board
bPlace: http://ohwr .org/cernohl | CERN OHL v.1.2 or later | snc98 3x4 Switch-block Rev. 0.5 | source | open | https://oshpark.com/profiles/Jens_G